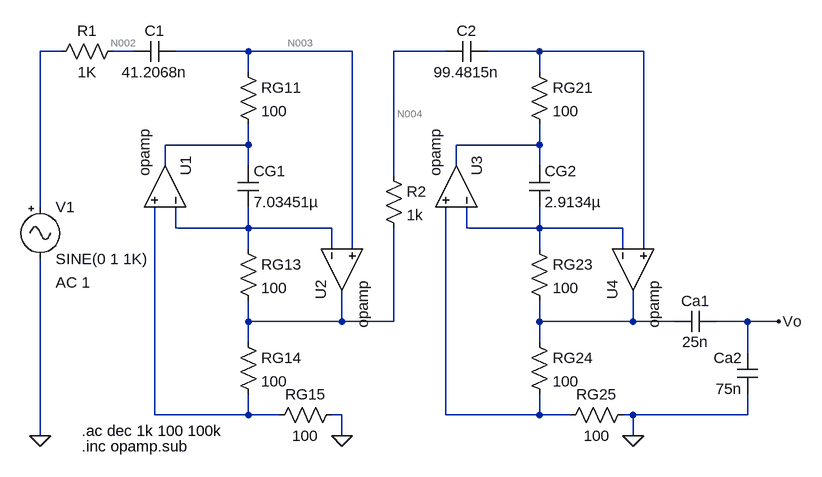
[diagram p0: schematic Ejercicio_4.asc]
Ejercicio_4.asc, the LTspice schematic file:
Version 4
SHEET 1 1240 1220
WIRE -320 176 -352 176
WIRE -208 176 -240 176
WIRE -32 176 -144 176
WIRE 128 176 -32 176
WIRE 272 176 192 176
WIRE 416 176 336 176
WIRE 576 176 416 176
WIRE -32 208 -32 176
WIRE 416 208 416 176
WIRE -32 320 -32 288
WIRE -32 320 -160 320
WIRE 416 320 416 288
WIRE 416 320 288 320
WIRE -160 352 -160 320
WIRE -32 352 -32 320
WIRE 288 352 288 320
WIRE 416 352 416 320
WIRE 192 368 192 176
WIRE -352 416 -352 176
WIRE -144 448 -144 416
WIRE -32 448 -32 416
WIRE -32 448 -144 448
WIRE 96 448 -32 448
WIRE 304 448 304 416
WIRE 416 448 416 416
WIRE 416 448 304 448
WIRE 544 448 416 448
WIRE -32 480 -32 448
WIRE 96 480 96 448
WIRE 128 480 128 176
WIRE 416 480 416 448
WIRE 544 480 544 448
WIRE 576 480 576 176
WIRE -32 592 -32 560
WIRE 112 592 112 544
WIRE 112 592 -32 592
WIRE 192 592 192 448
WIRE 192 592 112 592
WIRE 416 592 416 560
WIRE 560 592 560 544
WIRE 560 592 416 592
WIRE 624 592 560 592
WIRE 736 592 688 592
WIRE 784 592 736 592
WIRE -32 624 -32 592
WIRE 416 624 416 592
WIRE 736 640 736 592
WIRE -176 736 -176 416
WIRE -32 736 -32 704
WIRE -32 736 -176 736
WIRE 16 736 -32 736
WIRE 112 736 96 736
WIRE 272 736 272 416
WIRE 416 736 416 704
WIRE 416 736 272 736
WIRE 464 736 416 736
WIRE 560 736 544 736
WIRE 736 736 736 704
WIRE 736 736 560 736
WIRE -352 768 -352 496
WIRE 112 768 112 736
WIRE 560 768 560 736
FLAG 112 768 0
FLAG 560 768 0
FLAG -352 768 0
FLAG 784 592 Vo
SYMBOL Misc\\signal -352 400 R0
WINDOW 123 24 132 Left 2
WINDOW 39 0 0 Left 0
SYMATTR Value2 AC 1
SYMATTR InstName V1
SYMBOL res -224 160 R90
WINDOW 0 0 56 VBottom 2
WINDOW 3 32 56 VTop 2
SYMATTR InstName R1
SYMATTR Value 1K
SYMBOL res 176 352 R0
SYMATTR InstName R2
SYMATTR Value 1k
SYMBOL cap -144 160 R90
WINDOW 0 0 32 VBottom 2
WINDOW 3 32 32 VTop 2
SYMATTR InstName C1
SYMATTR Value 41.2068n
SYMBOL cap 336 160 R90
WINDOW 0 0 32 VBottom 2
WINDOW 3 32 32 VTop 2
SYMATTR InstName C2
SYMATTR Value 99.4815n
SYMBOL res -48 192 R0
SYMATTR InstName RG11
SYMATTR Value 100
SYMBOL cap -48 352 R0
SYMATTR InstName CG1
SYMATTR Value 7.03451µ
SYMBOL OpAmps\\opamp -96 384 M270
SYMATTR InstName U1
SYMBOL res -48 464 R0
SYMATTR InstName RG13
SYMATTR Value 100
SYMBOL OpAmps\\opamp 48 512 M90
SYMATTR InstName U2
SYMBOL res -48 608 R0
SYMATTR InstName RG14
SYMATTR Value 100
SYMBOL res 112 720 R90
WINDOW 0 0 56 VBottom 2
WINDOW 3 32 56 VTop 2
SYMATTR InstName RG15
SYMATTR Value 100
SYMBOL res 400 192 R0
SYMATTR InstName RG21
SYMATTR Value 100
SYMBOL cap 400 352 R0
SYMATTR InstName CG2
SYMATTR Value 2.9134µ
SYMBOL OpAmps\\opamp 352 384 M270
SYMATTR InstName U3
SYMBOL res 400 464 R0
SYMATTR InstName RG23
SYMATTR Value 100
SYMBOL OpAmps\\opamp 496 512 M90
SYMATTR InstName U4
SYMBOL res 400 608 R0
SYMATTR InstName RG24
SYMATTR Value 100
SYMBOL res 560 720 R90
WINDOW 0 0 56 VBottom 2
WINDOW 3 32 56 VTop 2
SYMATTR InstName RG25
SYMATTR Value 100
SYMBOL cap 688 576 R90
WINDOW 0 0 32 VBottom 2
WINDOW 3 32 32 VTop 2
SYMATTR InstName Ca1
SYMATTR Value 25n
SYMBOL cap 752 704 R180
WINDOW 0 24 56 Left 2
WINDOW 3 24 8 Left 2
SYMATTR InstName Ca2
SYMATTR Value 75n
TEXT -288 784 Left 2 !.inc opamp.sub
TEXT -288 760 Left 2 !.ac dec 1k 100 100k

The netlist it stands for:
* Ejercicio_4.asc
V1 N001 0 SINE(0 1 1K) AC 1
R1 N002 N001 1K
R2 N004 N010 1k
C1 N003 N002 41.2068n
C2 N005 N004 99.4815n
RG11 N003 N006 100
CG1 N006 N008 7.03451µ
XU1 N008 N012 N006 opamp Aol=100K GBW=10Meg  ; pins invin noninvin out
RG13 N008 N010 100
XU2 N008 N003 N010 opamp Aol=100K GBW=10Meg  ; pins invin noninvin out
RG14 N010 N012 100
RG15 0 N012 100
RG21 N005 N007 100
CG2 N007 N009 2.9134µ
XU3 N009 N013 N007 opamp Aol=100K GBW=10Meg  ; pins invin noninvin out
RG23 N009 N011 100
XU4 N009 N005 N011 opamp Aol=100K GBW=10Meg  ; pins invin noninvin out
RG24 N011 N013 100
RG25 0 N013 100
Ca1 Vo N011 25n
Ca2 0 Vo 75n
.inc opamp.sub
.ac dec 1k 100 100k
.backanno
.end

* Results of the author's LTspice run, read from the files saved beside the schematic
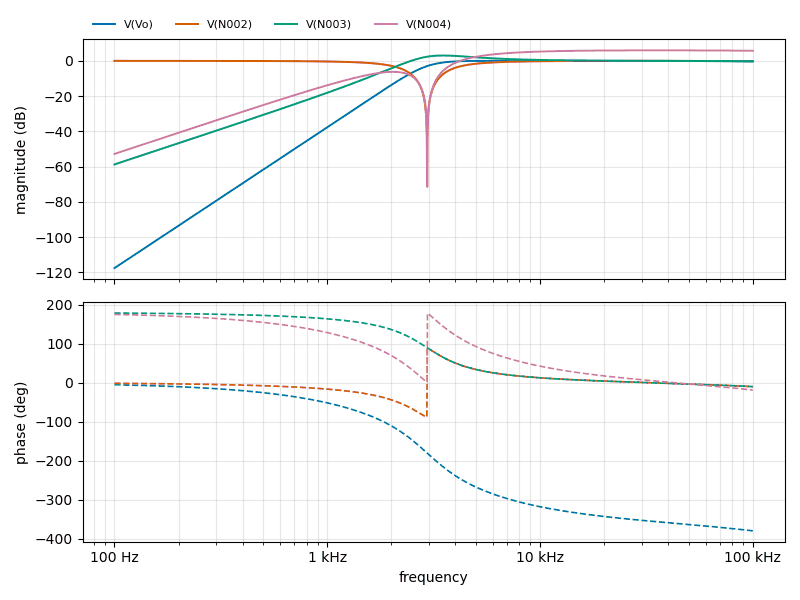
[diagram p1: AC Analysis of Ejercicio_4.asc, plotted from the saved traces]
* AC Analysis, 1 run:
*   V(Vo): -117.66 dB at 100 Hz, -0.34 dB at 100 kHz, peak 0.03 dB at 9.572 kHz, 3 dB below the peak at 2.946 kHz
*   V(N002): -0.00 dB at 100 Hz, -0.15 dB at 100 kHz, peak -0.00 dB at 100 Hz, 3 dB below the peak at 2.032 kHz
*   V(N003): -58.82 dB at 100 Hz, -0.21 dB at 100 kHz, peak 3.05 dB at 3.499 kHz, 3 dB below the peak at 2.481 kHz and 26.19 kHz
*   V(N004): -52.82 dB at 100 Hz, 5.70 dB at 100 kHz, peak 5.98 dB at 37.67 kHz, 3 dB below the peak at 5.401 kHz